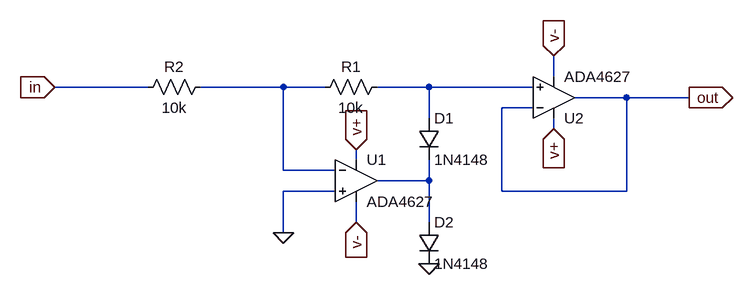
[diagram p0: schematic Draft4.asc]
Draft4.asc, the LTspice schematic file:
Version 4
SHEET 1 880 680
WIRE 176 96 176 64
WIRE -448 112 -592 112
WIRE -240 112 -368 112
WIRE -176 112 -240 112
WIRE -16 112 -96 112
WIRE 144 112 -16 112
WIRE 288 128 208 128
WIRE 384 128 288 128
WIRE 144 144 96 144
WIRE -16 160 -16 112
WIRE 176 176 176 160
WIRE -128 224 -128 208
WIRE -240 240 -240 112
WIRE -160 240 -240 240
WIRE -16 256 -16 224
WIRE -16 256 -96 256
WIRE -160 272 -240 272
WIRE 96 272 96 144
WIRE 288 272 288 128
WIRE 288 272 96 272
WIRE -128 320 -128 288
WIRE -16 320 -16 256
WIRE -240 336 -240 272
FLAG -16 384 0
FLAG -240 336 0
FLAG -592 112 in
IOPIN -592 112 In
FLAG -128 320 v-
IOPIN -128 320 In
FLAG -128 208 v+
IOPIN -128 208 In
FLAG 176 176 v+
IOPIN 176 176 In
FLAG 176 64 v-
IOPIN 176 64 In
FLAG 384 128 out
IOPIN 384 128 Out
SYMBOL diode -32 160 R0
SYMATTR InstName D1
SYMATTR Value 1N4148
SYMBOL diode -32 320 R0
SYMATTR InstName D2
SYMATTR Value 1N4148
SYMBOL res -80 96 R90
WINDOW 0 0 56 VBottom 2
WINDOW 3 32 56 VTop 2
SYMATTR InstName R1
SYMATTR Value 10k
SYMBOL res -352 96 R90
WINDOW 0 0 56 VBottom 2
WINDOW 3 32 56 VTop 2
SYMATTR InstName R2
SYMATTR Value 10k
SYMBOL OpAmps\\ADA4627 -128 192 R0
SYMATTR InstName U1
SYMBOL OpAmps\\ADA4627 176 192 M180
SYMATTR InstName U2

The netlist it stands for:
* Draft4.asc
D1 N002 N003 1N4148
D2 N003 0 1N4148
R1 N002 N001 10k
R2 N001 in 10k
XU1 0 N001 v+ v- N003 ADA4627  ; pins In+ In- V+ V- OUT
XU2 N002 out v+ v- out ADA4627  ; pins In+ In- V+ V- OUT
.model D D
.lib standard.dio
.backanno
.end